# EAGLE design vsrm (EAGLE 6.0)
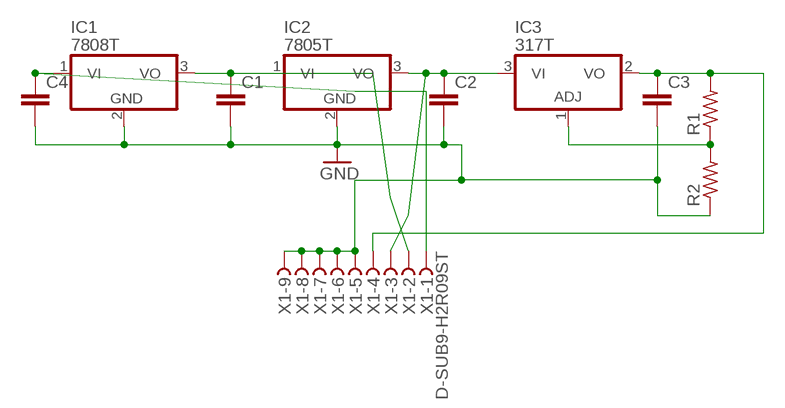
[diagram p0: schematic, sheet 1]

## Parts
C1  C2.5/4  [C2.5-4]
C2  C2.5/4  [C2.5-4]
C3  C2.5/4  [C2.5-4]
C4  C2.5/4  [C2.5-4]
IC1  7808T  [TO220H]
IC2  7805T  [TO220H]
IC3  317T  [TO220H]
R1  R-US_0204/7  [0204/7]
R2  R-US_0204/7  [0204/7]
X1  D-SUB9-H2R09ST  [H2R09ST]

## Nets
GND: C1.2 C2.2 C3.2 C4.2 IC1.2(GND) IC2.2(GND) R2.1 X1.5 X1.6 X1.7 X1.8 X1.9
N$1: C1.1 IC1.3(VO) IC2.1(VI) X1.2
N$2: C3.1 IC3.2(VO) R1.2 X1.4
N$3: C2.1 IC2.3(VO) IC3.3(VI) X1.3
N$4: C4.1 IC1.1(VI) X1.1
N$6: IC3.1(ADJ) R1.1 R2.2

## Library data of the parts
C1-C4 = capacitor-wima:C: CAPACITOR naming: grid - package width
IC1 IC2 = linear:78*: Positive VOLTAGE REGULATOR Source: http://cache.national.com/ds/LM/LM78L05.pdf http://www.fairchildsemi.com/ds/LM/LM7805.pdf
IC3 = linear:*317: Positive VOLTAGE REGULATOR
R1 R2 = resistor:R-US_: RESISTOR, American symbol
X1 = con-thomas-betts:D-SUB9-: D-Subminiatur Connector Source: Electronioc Interconnects European Edition 1998; OC_FARNELL: unknown; OC_NEWARK: unknown

## Board
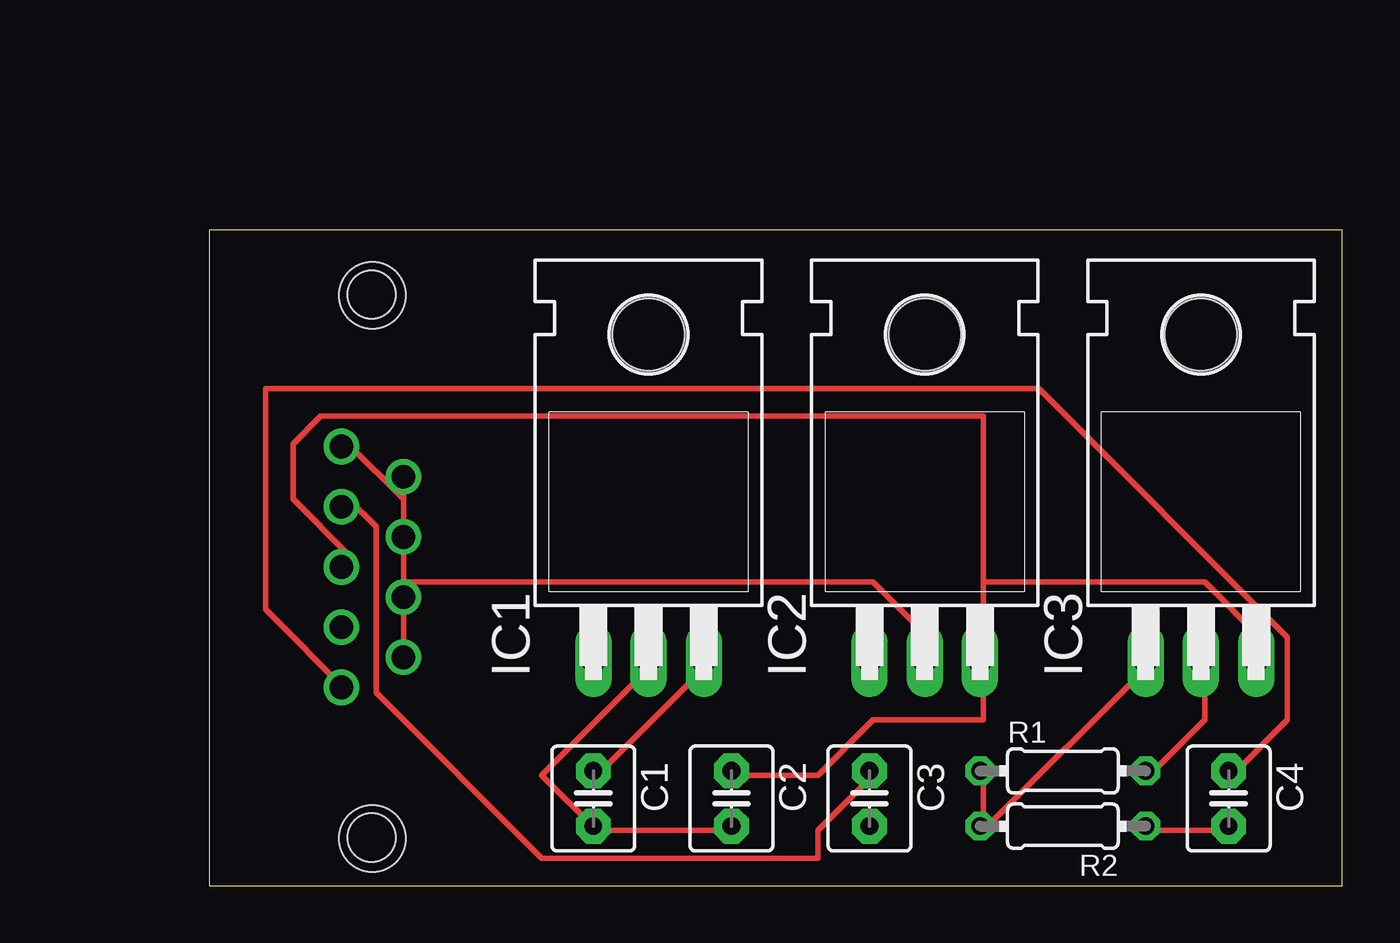
[diagram p1: board, top side]
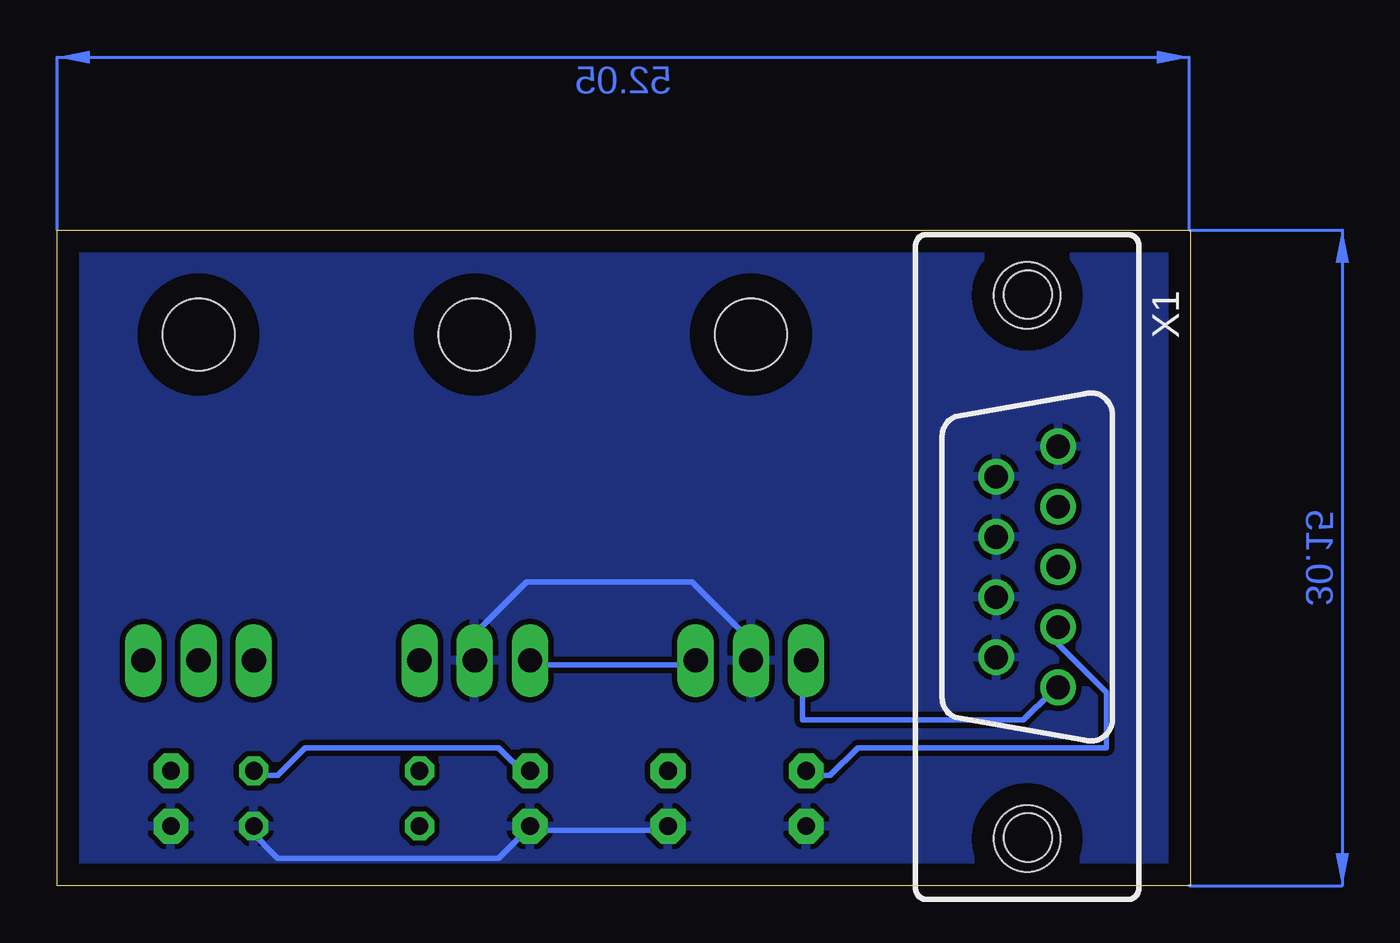
[diagram p2: board, bottom side, seen from below]

Size 52.09 x 30.16 mm. Coordinates in mm from the lower left corner, seen from the top.
Outline: 0,0 52.09,0 52.09,30.15 0,30.16 0,0
Copper layers (1*16): Top 0.035mm / dielectric 1.5mm / Bottom 0.035mm
Design rules: minimum track width 10mil, minimum drill 24mil, track to track 8mil, track to pad 8mil, pad to pad 8mil, via to via 8mil, smd to smd 8mil, copper to edge 40mil, drill to drill 8mil, minimum pad ring 10mil, minimum via ring 8mil, stop-mask expansion 4mil, vias tented up to drill 0mil, thermal gap 10mil
Holes 2.2 mm at 7.47,27.18 7.47,2.21

### Footprints (pad centres in the part's own frame; a part is rotated, then mirrored left to right if it is on the bottom)
C2.5-4 = drill 0.813 pad 1.6 octagon: 1 -1.27,0; 2 1.27,0
TO220H = drill 1.118 long: 1 -2.54,-10.16; 2 0,-10.16; 3 2.54,-10.16 | hole 3.302: 0,4.826
0204/7 = drill 0.813 octagon: 1 -3.81,0; 2 3.81,0
H2R09ST = drill 1.092: 1 5.537,1.422; 2 2.769,1.422; 3 0,1.422; 4 -2.769,1.422; 5 -5.537,1.422; 6 4.153,-1.422; 7 1.384,-1.422; 8 -1.384,-1.422; 9 -4.153,-1.422 | hole 3.048: -12.497,0; 12.497,0

### Placement (x,y rotation side)
C1  17.66,4.01 270 top
C2  24.01,4.01 270 top
C3  30.36,4.01 270 top
C4  46.87,4.01 270 top
IC1  20.2,20.52 0 top
IC2  32.9,20.52 0 top
IC3  45.6,20.52 0 top
R1  39.25,5.28 0 top
R2  39.25,2.74 180 top
X1  7.5,14.66 270 bottom

### Tracks (layer width: path | path; a pad name or v marks a point on that pad's centre or on a via)
GND
  Top 0.254: X1.6 8.93,10.16 8.93,12.7 X1.7 8.93,13.97 | 8.93,13.97 8.93,15.24 X1.8 8.93,16.51 8.93,17.78 | 8.93,17.78 8.93,19.05 X1.9 | 8.93,17.78 6.39,20.32 X1.5 | 8.93,13.97 30.52,13.97 33.06,11.43 IC2.2 | R2.1 43.22,2.54 47.03,2.54 C4.2 | 17.82,2.54 24.17,2.54 C2.2 | 17.82,2.54 15.28,5.08 20.36,10.16 IC1.2 | 17.82,2.54 C1.2
  Bottom 0.254: 30.52,2.54 24.17,2.54 C2.2 | 30.52,2.54 31.79,1.27 41.95,1.27 43.22,2.54 R2.1 | 30.52,2.54 C3.2 | IC2.2 33.06,11.43 30.52,13.97 22.9,13.97 20.36,11.43 IC1.2
  pour Bottom (isolate 0.254): 0.01,30.17 52.15,30.17 52.15,0.16 0.03,0.16
N$1
  Top 0.254: C1.1 17.82,5.08 22.9,10.16 IC1.3
  Bottom 0.254: X1.2 6.39,11.43 3.85,8.89 3.85,6.35 15.28,6.35 16.55,5.08 17.82,5.08 C1.1 | IC2.1 30.52,10.16 22.9,10.16 IC1.3
N$2
  Top 0.254: R1.2 43.22,5.08 45.76,7.62 45.76,10.16 IC3.2 | X1.4 6.39,17.78 7.66,16.51 7.66,8.89 15.28,1.27 27.98,1.27 27.98,2.54 30.52,5.08 C3.1
  Bottom 0.254: C3.1 30.52,5.08 31.79,6.35 40.68,6.35 41.95,5.08 43.22,5.08 R1.2
N$3
  Top 0.254: C2.1 24.17,5.08 27.98,5.08 30.52,7.62 35.6,7.62 35.6,10.16 IC2.3 35.6,11.43 35.6,13.97 | 35.6,13.97 35.6,21.59 5.12,21.59 3.85,20.32 3.85,17.78 6.39,15.24 X1.3 | 35.6,13.97 45.76,13.97 48.3,11.43 IC3.3
N$4
  Top 0.254: C4.1 47.03,5.08 49.57,7.62 49.57,11.43 38.14,22.86 2.58,22.86 2.58,12.7 6.39,8.89 X1.1
  Bottom 0.254: IC1.1 17.82,10.16 17.82,7.62 7.66,7.62 6.39,8.89 X1.1
N$6
  Top 0.254: 35.6,2.54 35.6,5.08 R1.1 | 35.6,2.54 43.22,10.16 IC3.1 | 35.6,2.54 R2.2
(copper drawn outside any net)
  shapes: Bottom area x2